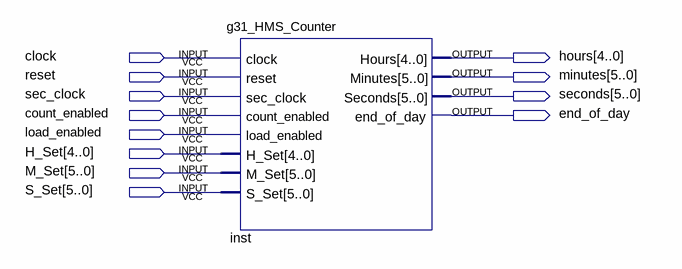
[diagram p0: schematic sheet]
// Quartus schematic g31_HMS_Counter_Circuit.bdf as structural Verilog: 1 symbols, 12 pins
module g31_HMS_Counter_Circuit (
  input  clock,
  input  reset,
  input  sec_clock,
  input  count_enabled,
  input  load_enabled,
  input  [4:0] H_Set,
  input  [5:0] M_Set,
  input  [5:0] S_Set,
  output [4:0] hours,
  output [5:0] minutes,
  output [5:0] seconds,
  output end_of_day
);

  g31_HMS_Counter inst (
    .clock(clock), .reset(reset), .sec_clock(sec_clock), .count_enabled(count_enabled),
    .load_enabled(load_enabled), .H_Set(H_Set), .M_Set(M_Set), .S_Set(S_Set), .Hours(hours),
    .Minutes(minutes), .Seconds(seconds), .end_of_day(end_of_day));
endmodule
